# Altium schematic sheet P01_Title Page.SchDoc
size 386 x 246 mm
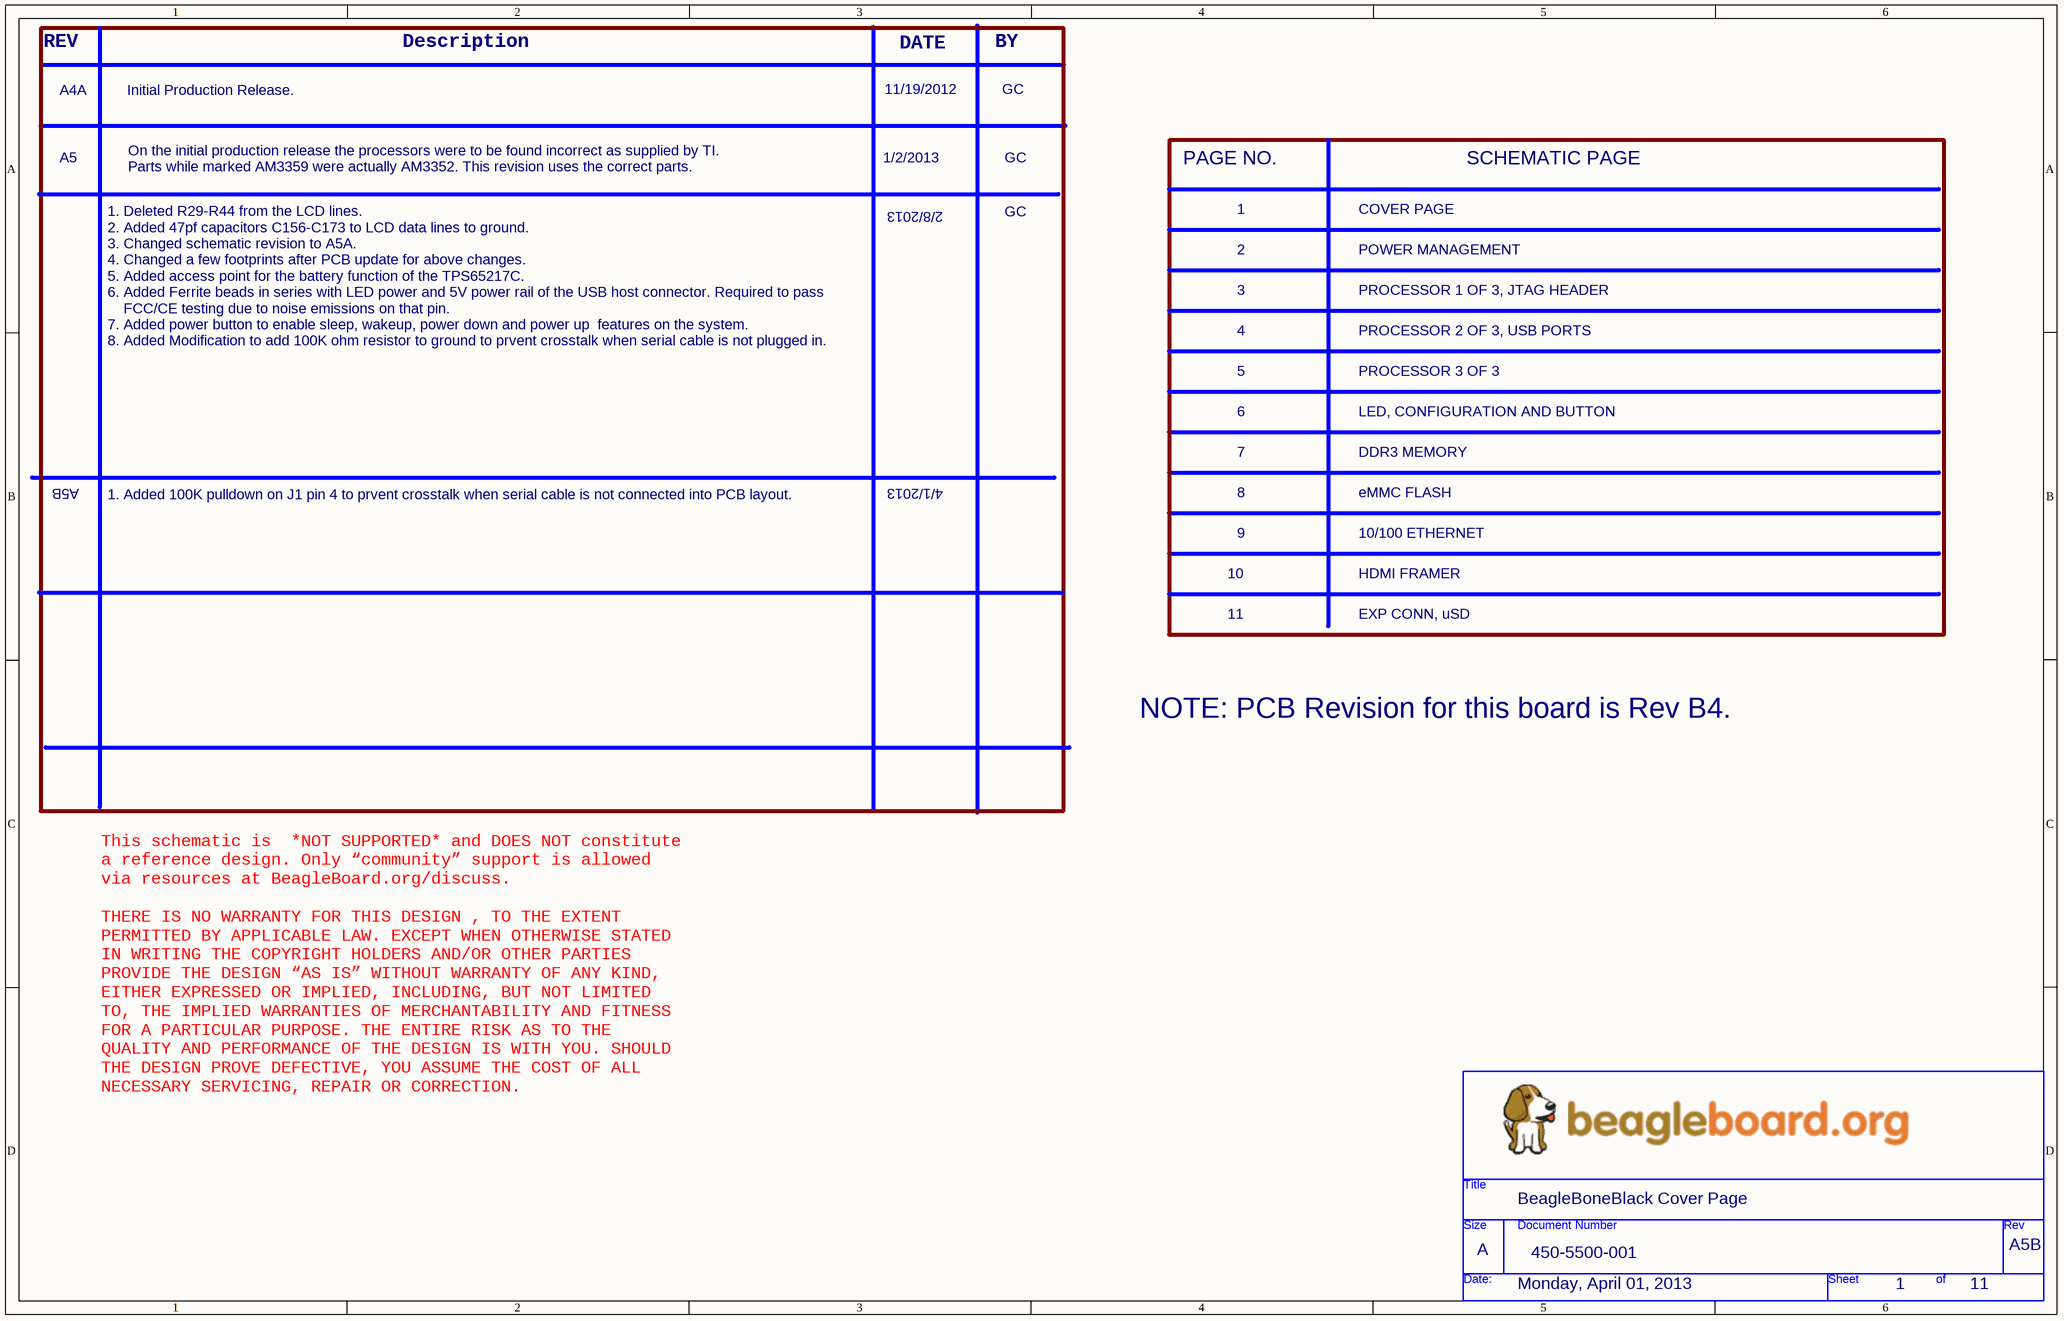
[diagram p0: P01_Title Page.SchDoc]

## Parts
*  Page Create Date: Monday, April 01, 2013  Doc: 450-5500-001  RevCode: A5B  Title: BeagleBoneBlack Cover Page  Page Size: A  Page Number: 1  Page Count: 11  (hidden comment: BeagleBoard_org)  (graphical)

## Notes on the sheet
- REV
- Description
- DATE
- BY
- A4A
- Initial Production Release.
- 11/19/2012
- GC
- A5
- On the initial production release the processors were to be found incorrect as supplied by TI.
  Parts while marked AM3359 were actually AM3352. This revision uses the correct parts.
- 1/2/2013
- PAGE NO.
- SCHEMATIC PAGE
- 2/8/2013
- 1
- 2
- POWER MANAGEMENT
- COVER PAGE
- 3
- PROCESSOR 1 OF 3, JTAG HEADER
- 4
- 5
- PROCESSOR 2 OF 3, USB PORTS
- PROCESSOR 3 OF 3
- 1. Deleted R29-R44 from the LCD lines.
  2. Added 47pf capacitors C156-C173 to LCD data lines to ground.
  3. Changed schematic revision to A5A.
  4. Changed a few footprints after PCB update for above changes.
  5. Added access point for the battery function of the TPS65217C.
  6. Added Ferrite beads in series with LED power and 5V power rail of the USB host connector. Required to pass
  FCC/CE testing due to noise emissions on that pin.
  7. Added power button to enable sleep, wakeup, power down and power up  features on the system.
  8. Added Modification to add 100K ohm resistor to ground to prvent crosstalk when serial cable is not plugged in.
- 7
- 6
- DDR3 MEMORY
- LED, CONFIGURATION AND BUTTON
- A5B
- 4/1/2013
- 8
- eMMC FLASH
- 1. Added 100K pulldown on J1 pin 4 to prvent crosstalk when serial cable is not connected into PCB layout.
- 10
- 9
- HDMI FRAMER
- 10/100 ETHERNET
- 11
- EXP CONN, uSD
- NOTE: PCB Revision for this board is Rev B4.
- This schematic is  *NOT SUPPORTED* and DOES NOT constitute
  a reference design. Only “community” support is allowed
  via resources at BeagleBoard.org/discuss.
  THERE IS NO WARRANTY FOR THIS DESIGN , TO THE EXTENT
  PERMITTED BY APPLICABLE LAW. EXCEPT WHEN OTHERWISE STATED
  IN WRITING THE COPYRIGHT HOLDERS AND/OR OTHER PARTIES
  PROVIDE THE DESIGN “AS IS” WITHOUT WARRANTY OF ANY KIND,
  EITHER EXPRESSED OR IMPLIED, INCLUDING, BUT NOT LIMITED
  TO, THE IMPLIED WARRANTIES OF MERCHANTABILITY AND FITNESS
  FOR A PARTICULAR PURPOSE. THE ENTIRE RISK AS TO THE
  QUALITY AND PERFORMANCE OF THE DESIGN IS WITH YOU. SHOULD
  THE DESIGN PROVE DEFECTIVE, YOU ASSUME THE COST OF ALL
  NECESSARY SERVICING, REPAIR OR CORRECTION.
- (in symbol BeagleBoard_org) Title; Size; Document Number; Rev; Date:; Sheet; of